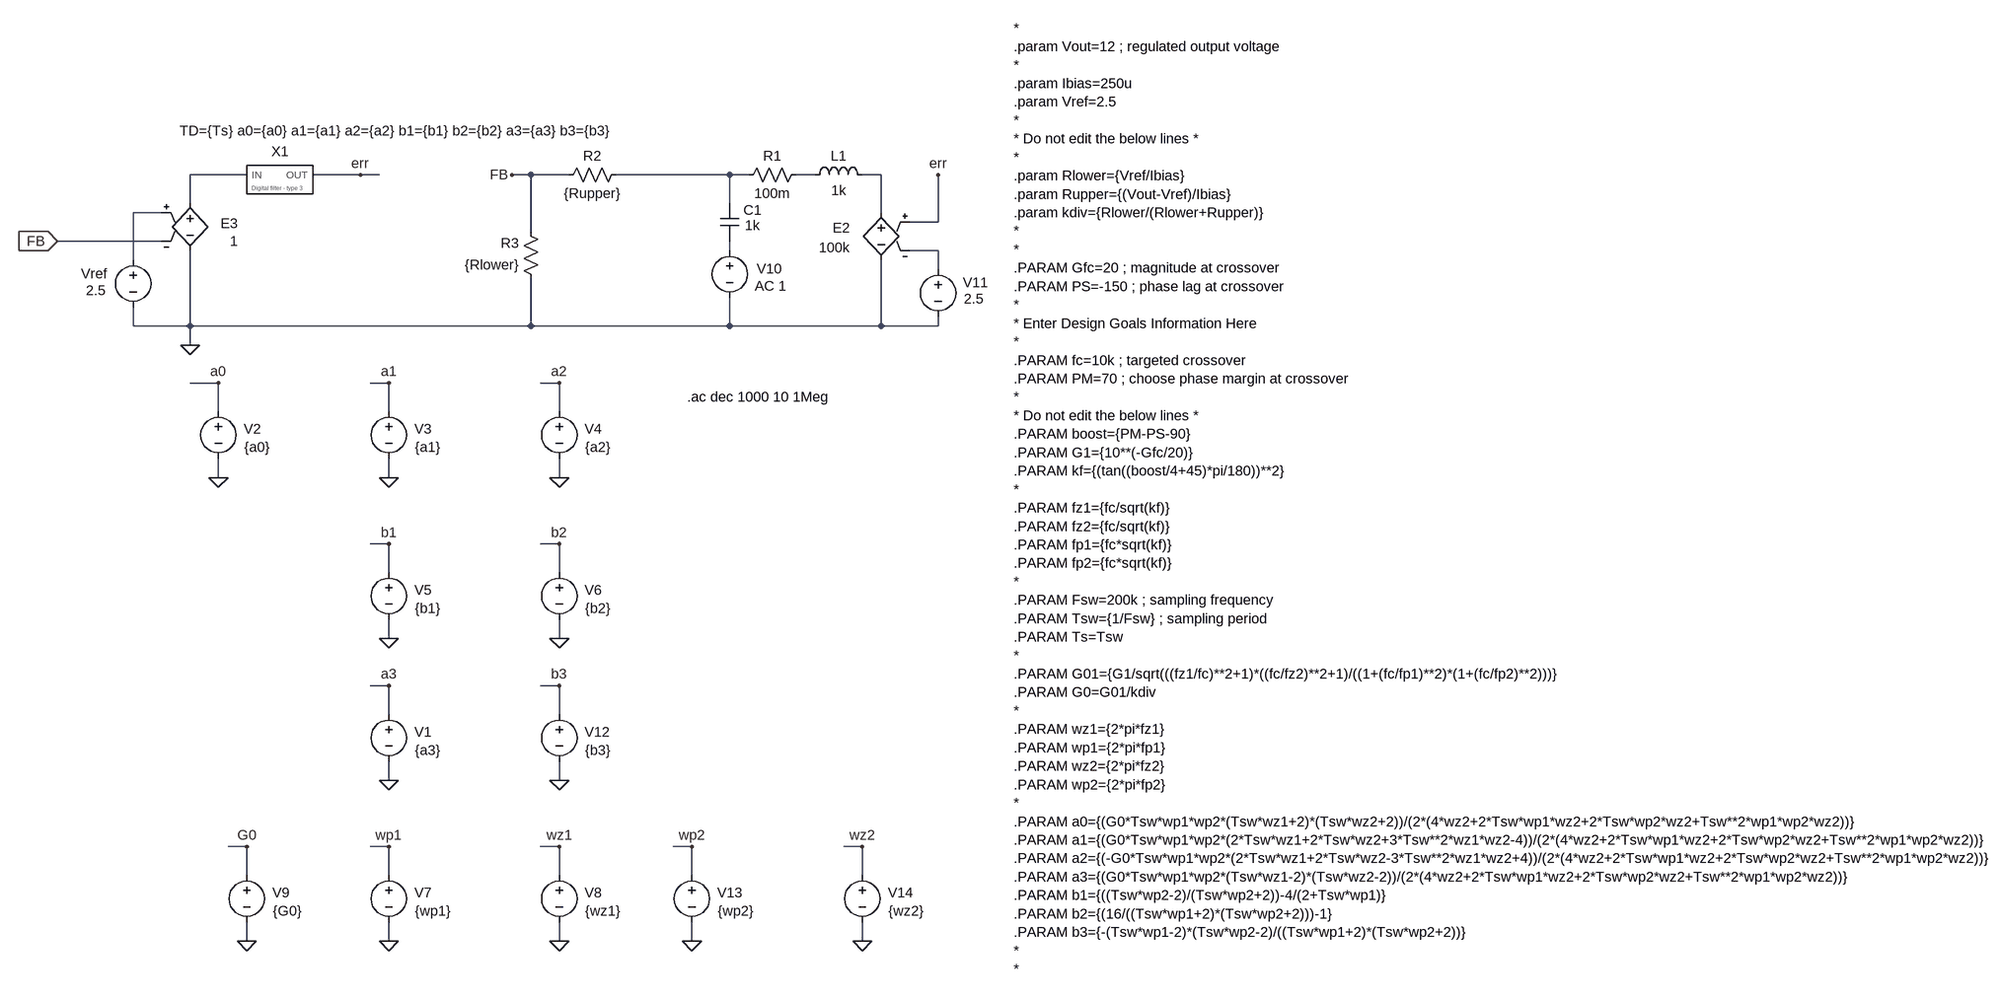
[diagram p0: schematic Type 3 digital - delay lines.asc]
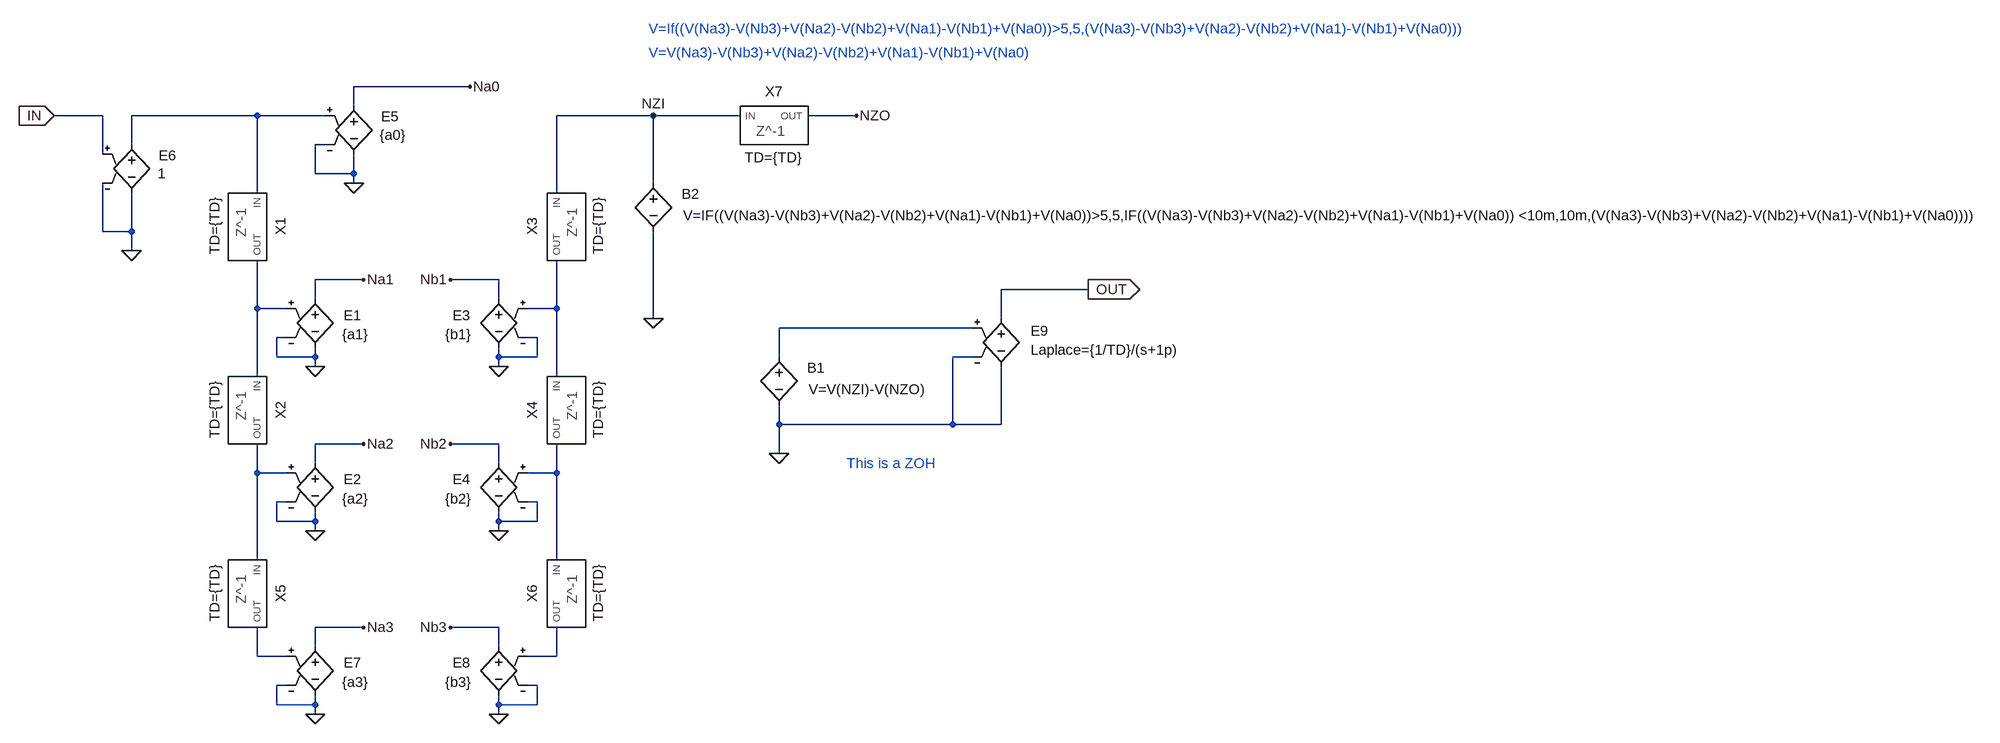
[diagram p1: sub-circuit type_3_digital.asc]
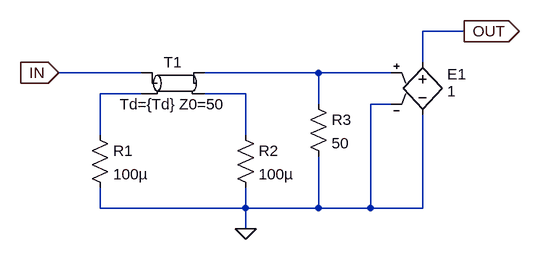
[diagram p2: sub-circuit zminus1.asc]
Type 3 digital - delay lines.asc, the LTspice schematic file:
Version 4
SHEET 1 2968 1524
WIRE -272 48 -368 48
WIRE -80 48 -160 48
WIRE -48 48 -80 48
WIRE 208 48 176 48
WIRE 272 48 208 48
WIRE 544 48 352 48
WIRE 576 48 544 48
WIRE 688 48 656 48
WIRE 800 48 768 48
WIRE -368 96 -368 48
WIRE 544 96 544 48
WIRE -416 112 -464 112
WIRE 800 112 800 48
WIRE 896 128 896 48
WIRE 896 128 848 128
WIRE 208 144 208 48
WIRE -416 160 -592 160
WIRE 544 176 544 160
WIRE 896 176 848 176
WIRE -464 192 -464 112
WIRE 896 208 896 176
WIRE -464 304 -464 272
WIRE -368 304 -368 176
WIRE -368 304 -464 304
WIRE 208 304 208 224
WIRE 208 304 -368 304
WIRE 544 304 544 256
WIRE 544 304 208 304
WIRE 800 304 800 192
WIRE 800 304 544 304
WIRE 896 304 896 288
WIRE 896 304 800 304
WIRE -368 336 -368 304
WIRE -320 400 -368 400
WIRE -32 400 -64 400
WIRE 256 400 224 400
WIRE -320 448 -320 400
WIRE -32 448 -32 400
WIRE 256 448 256 400
WIRE -320 560 -320 528
WIRE -32 560 -32 528
WIRE 256 560 256 528
WIRE -32 672 -64 672
WIRE 256 672 224 672
WIRE -32 720 -32 672
WIRE 256 720 256 672
WIRE -32 832 -32 800
WIRE 256 832 256 800
WIRE -32 912 -64 912
WIRE 256 912 224 912
WIRE -32 960 -32 912
WIRE 256 960 256 912
WIRE -32 1072 -32 1040
WIRE 256 1072 256 1040
WIRE -272 1184 -304 1184
WIRE -32 1184 -64 1184
WIRE 256 1184 224 1184
WIRE 480 1184 448 1184
WIRE 768 1184 736 1184
WIRE -272 1232 -272 1184
WIRE -32 1232 -32 1184
WIRE 256 1232 256 1184
WIRE 480 1232 480 1184
WIRE 768 1232 768 1184
WIRE -272 1344 -272 1312
WIRE -32 1344 -32 1312
WIRE 256 1344 256 1312
WIRE 480 1344 480 1312
WIRE 768 1344 768 1312
FLAG -368 336 0
FLAG -320 560 0
FLAG -32 560 0
FLAG -320 400 a0
FLAG -32 400 a1
FLAG 256 560 0
FLAG -32 832 0
FLAG 256 400 a2
FLAG -32 672 b1
FLAG 256 832 0
FLAG 256 672 b2
FLAG -32 1344 0
FLAG -32 1184 wp1
FLAG 256 1344 0
FLAG 256 1184 wz1
FLAG -80 48 err
FLAG -272 1344 0
FLAG -272 1184 G0
FLAG 896 48 err
FLAG 176 48 FB
FLAG -592 160 FB
IOPIN -592 160 In
FLAG -32 1072 0
FLAG -32 912 a3
FLAG 256 1072 0
FLAG 256 912 b3
FLAG 480 1344 0
FLAG 480 1184 wp2
FLAG 768 1344 0
FLAG 768 1184 wz2
DATAFLAG -368 400 ""
DATAFLAG -64 400 ""
DATAFLAG 224 400 ""
DATAFLAG -64 672 ""
DATAFLAG 224 672 ""
DATAFLAG -64 1184 ""
DATAFLAG 224 1184 ""
DATAFLAG -304 1184 ""
DATAFLAG 464 48 ""
DATAFLAG -48 48 ""
DATAFLAG -64 912 ""
DATAFLAG 224 912 ""
DATAFLAG 448 1184 ""
DATAFLAG 736 1184 ""
SYMBOL voltage -320 432 R0
WINDOW 0 43 46 Left 2
WINDOW 3 44 77 Left 2
SYMATTR InstName V2
SYMATTR Value {a0}
SYMBOL voltage -32 432 R0
WINDOW 0 43 46 Left 2
WINDOW 3 44 77 Left 2
SYMATTR InstName V3
SYMATTR Value {a1}
SYMBOL voltage 256 432 R0
WINDOW 0 43 46 Left 2
WINDOW 3 44 77 Left 2
SYMATTR InstName V4
SYMATTR Value {a2}
SYMBOL voltage -32 704 R0
WINDOW 0 43 46 Left 2
WINDOW 3 44 77 Left 2
SYMATTR InstName V5
SYMATTR Value {b1}
SYMBOL voltage 256 704 R0
WINDOW 0 43 46 Left 2
WINDOW 3 44 77 Left 2
SYMATTR InstName V6
SYMATTR Value {b2}
SYMBOL voltage -32 1216 R0
WINDOW 0 43 46 Left 2
WINDOW 3 44 77 Left 2
SYMATTR InstName V7
SYMATTR Value {wp1}
SYMBOL voltage 256 1216 R0
WINDOW 0 43 46 Left 2
WINDOW 3 44 77 Left 2
SYMATTR InstName V8
SYMATTR Value {wz1}
SYMBOL voltage -272 1216 R0
WINDOW 0 43 46 Left 2
WINDOW 3 44 77 Left 2
SYMATTR InstName V9
SYMATTR Value {G0}
SYMBOL e 800 96 M0
WINDOW 0 53 42 Left 2
WINDOW 3 53 75 Left 2
SYMATTR InstName E2
SYMATTR Value 100k
SYMBOL ind 672 64 R270
WINDOW 0 32 56 VTop 2
WINDOW 3 5 56 VBottom 2
SYMATTR InstName L1
SYMATTR Value 1k
SYMBOL res 672 32 R90
WINDOW 0 0 56 VBottom 2
WINDOW 3 32 56 VTop 2
SYMATTR InstName R1
SYMATTR Value 100m
SYMBOL cap 528 96 R0
WINDOW 0 39 12 Left 2
WINDOW 3 42 38 Left 2
SYMATTR InstName C1
SYMATTR Value 1k
SYMBOL voltage 544 160 R0
WINDOW 0 46 47 Left 2
WINDOW 123 42 76 Left 2
WINDOW 39 0 0 Left 0
SYMATTR InstName V10
SYMATTR Value2 AC 1
SYMATTR Value ""
SYMBOL voltage 896 192 R0
WINDOW 0 42 38 Left 2
WINDOW 3 44 66 Left 2
SYMATTR InstName V11
SYMATTR Value 2.5
SYMBOL res 368 32 R90
WINDOW 0 0 56 VBottom 2
WINDOW 3 32 56 VTop 2
SYMATTR InstName R2
SYMATTR Value {Rupper}
SYMBOL res 224 240 R180
WINDOW 0 36 76 Left 2
WINDOW 3 36 40 Left 2
SYMATTR InstName R3
SYMATTR Value {Rlower}
SYMBOL voltage -464 176 M0
WINDOW 0 44 39 Left 2
WINDOW 3 46 68 Left 2
SYMATTR InstName Vref
SYMATTR Value 2.5
SYMBOL e -368 80 R0
WINDOW 0 52 50 Left 2
WINDOW 3 68 80 Left 2
SYMATTR InstName E3
SYMATTR Value 1
SYMBOL Type_3_digital -224 48 R0
WINDOW 39 204 -59 Bottom 2
SYMATTR InstName X1
SYMATTR SpiceLine TD={Ts} a0={a0} a1={a1} a2={a2} b1={b1} b2={b2} a3={a3} b3={b3}
SYMBOL voltage -32 944 R0
WINDOW 0 43 46 Left 2
WINDOW 3 44 77 Left 2
WINDOW 123 0 0 Left 0
WINDOW 39 0 0 Left 0
SYMATTR InstName V1
SYMATTR Value {a3}
SYMBOL voltage 256 944 R0
WINDOW 0 43 46 Left 2
WINDOW 3 44 77 Left 2
SYMATTR InstName V12
SYMATTR Value {b3}
SYMBOL voltage 480 1216 R0
WINDOW 0 43 46 Left 2
WINDOW 3 44 77 Left 2
SYMATTR InstName V13
SYMATTR Value {wp2}
SYMBOL voltage 768 1216 R0
WINDOW 0 43 46 Left 2
WINDOW 3 44 77 Left 2
SYMATTR InstName V14
SYMATTR Value {wz2}
TEXT 1024 -200 Left 2 !*\n.param Vout=12 ; regulated output voltage\n*\n.param Ibias=250u\n.param Vref=2.5\n*\n* Do not edit the below lines *\n*\n.param Rlower={Vref/Ibias}\n.param Rupper={(Vout-Vref)/Ibias}\n.param kdiv={Rlower/(Rlower+Rupper)}\n*\n*\n.PARAM Gfc=20 ; magnitude at crossover\n.PARAM PS=-150 ; phase lag at crossover\n*\n* Enter Design Goals Information Here\n*\n.PARAM fc=10k ; targeted crossover\n.PARAM PM=70 ; choose phase margin at crossover\n*\n* Do not edit the below lines *\n.PARAM boost={PM-PS-90}\n.PARAM G1={10**(-Gfc/20)}\n.PARAM kf={(tan((boost/4+45)*pi/180))**2}\n*\n.PARAM fz1={fc/sqrt(kf)}\n.PARAM fz2={fc/sqrt(kf)}\n.PARAM fp1={fc*sqrt(kf)}\n.PARAM fp2={fc*sqrt(kf)}\n*\n.PARAM Fsw=200k ; sampling frequency\n.PARAM Tsw={1/Fsw} ; sampling period\n.PARAM Ts=Tsw\n*\n.PARAM G01={G1/sqrt(((fz1/fc)**2+1)*((fc/fz2)**2+1)/((1+(fc/fp1)**2)*(1+(fc/fp2)**2)))}\n.PARAM G0=G01/kdiv\n*\n.PARAM wz1={2*pi*fz1}\n.PARAM wp1={2*pi*fp1}\n.PARAM wz2={2*pi*fz2}\n.PARAM wp2={2*pi*fp2}\n*\n.PARAM a0={(G0*Tsw*wp1*wp2*(Tsw*wz1+2)*(Tsw*wz2+2))/(2*(4*wz2+2*Tsw*wp1*wz2+2*Tsw*wp2*wz2+Tsw**2*wp1*wp2*wz2))}\n.PARAM a1={(G0*Tsw*wp1*wp2*(2*Tsw*wz1+2*Tsw*wz2+3*Tsw**2*wz1*wz2-4))/(2*(4*wz2+2*Tsw*wp1*wz2+2*Tsw*wp2*wz2+Tsw**2*wp1*wp2*wz2))}\n.PARAM a2={(-G0*Tsw*wp1*wp2*(2*Tsw*wz1+2*Tsw*wz2-3*Tsw**2*wz1*wz2+4))/(2*(4*wz2+2*Tsw*wp1*wz2+2*Tsw*wp2*wz2+Tsw**2*wp1*wp2*wz2))}\n.PARAM a3={(G0*Tsw*wp1*wp2*(Tsw*wz1-2)*(Tsw*wz2-2))/(2*(4*wz2+2*Tsw*wp1*wz2+2*Tsw*wp2*wz2+Tsw**2*wp1*wp2*wz2))}\n.PARAM b1={((Tsw*wp2-2)/(Tsw*wp2+2))-4/(2+Tsw*wp1)}\n.PARAM b2={(16/((Tsw*wp1+2)*(Tsw*wp2+2)))-1}\n.PARAM b3={-(Tsw*wp1-2)*(Tsw*wp2-2)/((Tsw*wp1+2)*(Tsw*wp2+2))}\n*\n*
TEXT 472 424 Left 2 !.ac dec 1000 10 1Meg

type_3_digital.asc, the sub-circuit schematic file:
Version 4.1
SHEET 1 3284 692
WIRE 544 -368 352 -368
WIRE 352 -336 352 -368
WIRE -64 -320 -144 -320
WIRE 192 -320 -16 -320
WIRE 304 -320 192 -320
WIRE 848 -320 688 -320
WIRE 992 -320 848 -320
WIRE 1184 -320 1104 -320
WIRE -16 -272 -16 -320
WIRE 304 -272 288 -272
WIRE -64 -256 -64 -320
WIRE 288 -224 288 -272
WIRE 352 -224 352 -256
WIRE 352 -224 288 -224
WIRE 352 -208 352 -224
WIRE 848 -208 848 -320
WIRE 192 -192 192 -320
WIRE 688 -192 688 -320
WIRE -64 -128 -64 -208
WIRE -16 -128 -16 -192
WIRE -16 -128 -64 -128
WIRE -16 -96 -16 -128
WIRE 368 -48 288 -48
WIRE 592 -48 512 -48
WIRE 1568 -32 1424 -32
WIRE 288 -16 288 -48
WIRE 592 -16 592 -48
WIRE 192 0 192 -80
WIRE 240 0 192 0
WIRE 688 0 688 -80
WIRE 688 0 640 0
WIRE 848 16 848 -128
WIRE 1424 16 1424 -32
WIRE 1376 32 1056 32
WIRE 240 48 224 48
WIRE 656 48 640 48
WIRE 224 80 224 48
WIRE 288 80 288 64
WIRE 288 80 224 80
WIRE 592 80 592 64
WIRE 656 80 656 48
WIRE 656 80 592 80
WIRE 1056 80 1056 32
WIRE 1376 80 1344 80
WIRE 288 96 288 80
WIRE 592 96 592 80
WIRE 192 112 192 0
WIRE 688 112 688 0
WIRE 1056 192 1056 160
WIRE 1344 192 1344 80
WIRE 1344 192 1056 192
WIRE 1424 192 1424 96
WIRE 1424 192 1344 192
WIRE 368 224 288 224
WIRE 592 224 512 224
WIRE 1056 240 1056 192
WIRE 288 256 288 224
WIRE 592 256 592 224
WIRE 192 272 192 224
WIRE 240 272 192 272
WIRE 688 272 688 224
WIRE 688 272 640 272
WIRE 240 320 224 320
WIRE 656 320 640 320
WIRE 224 352 224 320
WIRE 288 352 288 336
WIRE 288 352 224 352
WIRE 592 352 592 336
WIRE 656 352 656 320
WIRE 656 352 592 352
WIRE 288 368 288 352
WIRE 592 368 592 352
WIRE 192 416 192 272
WIRE 688 416 688 272
WIRE 368 528 288 528
WIRE 592 528 512 528
WIRE 288 560 288 528
WIRE 592 560 592 528
WIRE 192 576 192 528
WIRE 240 576 192 576
WIRE 688 576 688 528
WIRE 688 576 640 576
WIRE 240 624 224 624
WIRE 656 624 640 624
WIRE 224 656 224 624
WIRE 288 656 288 640
WIRE 288 656 224 656
WIRE 592 656 592 640
WIRE 656 656 656 624
WIRE 656 656 592 656
WIRE 288 672 288 656
WIRE 592 672 592 656
FLAG 288 96 0
FLAG 288 368 0
FLAG 368 -48 Na1
FLAG 368 224 Na2
FLAG 592 96 0
FLAG 592 368 0
FLAG 512 -48 Nb1
FLAG 512 224 Nb2
FLAG 352 -208 0
FLAG 544 -368 Na0
FLAG 848 16 0
FLAG 1568 -32 OUT
IOPIN 1568 -32 Out
FLAG -144 -320 IN
IOPIN -144 -320 In
FLAG -16 -96 0
FLAG 288 672 0
FLAG 368 528 Na3
FLAG 592 672 0
FLAG 512 528 Nb3
FLAG 1184 -320 NZO
FLAG 848 -320 NZI
FLAG 1056 240 0
SYMBOL Zminus1 192 -144 R90
WINDOW 39 7 85 Bottom 2
SYMATTR SpiceLine TD={TD}
SYMATTR InstName X1
SYMBOL Zminus1 192 160 R90
WINDOW 39 7 85 Bottom 2
SYMATTR SpiceLine TD={TD}
SYMATTR InstName X2
SYMBOL e 288 -32 R0
WINDOW 0 47 43 Left 2
WINDOW 3 45 75 Left 2
SYMATTR InstName E1
SYMATTR Value {a1}
SYMBOL e 288 240 R0
WINDOW 0 47 43 Left 2
WINDOW 3 45 75 Left 2
SYMATTR InstName E2
SYMATTR Value {a2}
SYMBOL Zminus1 688 -144 M90
WINDOW 39 7 85 Bottom 2
SYMATTR SpiceLine TD={TD}
SYMATTR InstName X3
SYMBOL Zminus1 688 160 M90
WINDOW 39 7 85 Bottom 2
SYMATTR SpiceLine TD={TD}
SYMATTR InstName X4
SYMBOL e 592 -32 M0
WINDOW 0 47 43 Left 2
WINDOW 3 45 75 Left 2
SYMATTR InstName E3
SYMATTR Value {b1}
SYMBOL e 592 240 M0
WINDOW 0 47 43 Left 2
WINDOW 3 45 75 Left 2
SYMATTR InstName E4
SYMATTR Value {b2}
SYMBOL e 352 -352 R0
WINDOW 0 45 34 Left 2
WINDOW 3 43 64 Left 2
SYMATTR InstName E5
SYMATTR Value {a0}
SYMBOL e -16 -288 R0
WINDOW 0 45 34 Left 2
WINDOW 3 43 64 Left 2
SYMATTR InstName E6
SYMATTR Value 1
SYMBOL Zminus1 192 464 R90
WINDOW 39 7 85 Bottom 2
SYMATTR SpiceLine TD={TD}
SYMATTR InstName X5
SYMBOL e 288 544 R0
WINDOW 0 47 43 Left 2
WINDOW 3 45 75 Left 2
SYMATTR InstName E7
SYMATTR Value {a3}
SYMBOL Zminus1 688 464 M90
WINDOW 39 7 85 Bottom 2
SYMATTR SpiceLine TD={TD}
SYMATTR InstName X6
SYMBOL e 592 544 M0
WINDOW 0 47 43 Left 2
WINDOW 3 45 75 Left 2
SYMATTR InstName E8
SYMATTR Value {b3}
SYMBOL bv 848 -224 R0
WINDOW 0 47 34 Left 2
WINDOW 3 49 70 Left 2
SYMATTR InstName B2
SYMATTR Value V=IF((V(Na3)-V(Nb3)+V(Na2)-V(Nb2)+V(Na1)-V(Nb1)+V(Na0))>5,5,IF((V(Na3)-V(Nb3)+V(Na2)-V(Nb2)+V(Na1)-V(Nb1)+V(Na0)) <10m,10m,(V(Na3)-V(Nb3)+V(Na2)-V(Nb2)+V(Na1)-V(Nb1)+V(Na0))))
SYMBOL Zminus1 1040 -320 R0
WINDOW 39 7 85 Bottom 2
SYMATTR SpiceLine TD={TD}
SYMATTR InstName X7
SYMBOL bv 1056 64 R0
WINDOW 0 47 34 Left 2
WINDOW 3 49 70 Left 2
SYMATTR InstName B1
SYMATTR Value V=V(NZI)-V(NZO)
SYMBOL e 1424 0 R0
WINDOW 0 49 37 Left 2
WINDOW 3 49 68 Left 2
SYMATTR InstName E9
SYMATTR Value Laplace={1/TD}/(s+1p)
TEXT 1168 256 Left 2 ;This is a ZOH
TEXT 840 -424 Left 2 ;V=V(Na3)-V(Nb3)+V(Na2)-V(Nb2)+V(Na1)-V(Nb1)+V(Na0)
TEXT 840 -464 Left 2 ;V=If((V(Na3)-V(Nb3)+V(Na2)-V(Nb2)+V(Na1)-V(Nb1)+V(Na0))>5,5,(V(Na3)-V(Nb3)+V(Na2)-V(Nb2)+V(Na1)-V(Nb1)+V(Na0)))

zminus1.asc, the sub-circuit schematic file:
Version 4
SHEET 1 880 680
WIRE 624 80 560 80
WIRE 560 128 560 80
WIRE 128 144 0 144
WIRE 400 144 224 144
WIRE 512 144 400 144
WIRE 128 176 64 176
WIRE 288 176 224 176
WIRE 400 192 400 144
WIRE 512 192 480 192
WIRE 64 240 64 176
WIRE 288 240 288 176
WIRE 64 352 64 320
WIRE 288 352 288 320
WIRE 288 352 64 352
WIRE 400 352 400 272
WIRE 400 352 288 352
WIRE 480 352 480 192
WIRE 480 352 400 352
WIRE 560 352 560 208
WIRE 560 352 480 352
WIRE 288 384 288 352
FLAG 624 80 OUT
IOPIN 624 80 Out
FLAG 0 144 IN
IOPIN 0 144 In
FLAG 288 384 0
SYMBOL tline 176 160 R0
SYMATTR InstName T1
SYMATTR Value Td={Td} Z0=50
SYMBOL res 48 224 R0
SYMATTR InstName R1
SYMATTR Value 100µ
SYMBOL res 272 224 R0
SYMATTR InstName R2
SYMATTR Value 100µ
SYMBOL res 384 176 R0
SYMATTR InstName R3
SYMATTR Value 50
SYMBOL e 560 112 R0
WINDOW 0 38 34 Left 2
WINDOW 3 38 60 Left 2
SYMATTR InstName E1
SYMATTR Value 1

The netlist it stands for:
* Type 3 digital - delay lines.asc
V2 a0 0 {a0}
V3 a1 0 {a1}
V4 a2 0 {a2}
V5 b1 0 {b1}
V6 b2 0 {b2}
V7 wp1 0 {wp1}
V8 wz1 0 {wz1}
V9 G0 0 {G0}
E2 N004 0 err N007 100k
L1 N003 N004 1k
R1 N003 N002 100m
C1 N002 N006 1k
V10 N006 0 AC 1
V11 N007 0 2.5
R2 N002 FB {Rupper}
R3 0 FB {Rlower}
Vref N005 0 2.5
E3 N001 0 N005 FB 1
XX1 N001 err type_3_digital params: TD={Ts} a0={a0} a1={a1} a2={a2} b1={b1} b2={b2} a3={a3} b3={b3}
V1 a3 0 {a3}
V12 b3 0 {b3}
V13 wp2 0 {wp2}
V14 wz2 0 {wz2}

* block symbol definitions
.subckt type_3_digital IN OUT
X§X1 N001 N002 zminus1 params: TD={TD}
X§X2 N002 N005 zminus1 params: TD={TD}
E1 Na1 0 N002 0 {a1}
E2 Na2 0 N005 0 {a2}
X§X3 NZI N003 zminus1 params: TD={TD}
X§X4 N003 N006 zminus1 params: TD={TD}
E3 Nb1 0 N003 0 {b1}
E4 Nb2 0 N006 0 {b2}
E5 Na0 0 N001 0 {a0}
E6 N001 0 IN 0 1
X§X5 N005 N007 zminus1 params: TD={TD}
E7 Na3 0 N007 0 {a3}
X§X6 N006 N008 zminus1 params: TD={TD}
E8 Nb3 0 N008 0 {b3}
B2 NZI 0 V=IF((V(Na3)-V(Nb3)+V(Na2)-V(Nb2)+V(Na1)-V(Nb1)+V(Na0))>5,5,IF((V(Na3)-V(Nb3)+V(Na2)-V(Nb2)+V(Na1)-V(Nb1)+V(Na0)) <10m,10m,(V(Na3)-V(Nb3)+V(Na2)-V(Nb2)+V(Na1)-V(Nb1)+V(Na0))))
X§X7 NZI NZO zminus1 params: TD={TD}
B1 N004 0 V=V(NZI)-V(NZO)
E9 OUT 0 N004 0 Laplace={1/TD}/(s+1p)
* This is a ZOH
* V=V(Na3)-V(Nb3)+V(Na2)-V(Nb2)+V(Na1)-V(Nb1)+V(Na0)
* V=If((V(Na3)-V(Nb3)+V(Na2)-V(Nb2)+V(Na1)-V(Nb1)+V(Na0))>5,5,(V(Na3)-V(Nb3)+V(Na2)-V(Nb2)+V(Na1)-V(Nb1)+V(Na0)))
.ends type_3_digital

.subckt zminus1 IN OUT
T1 IN N002 N001 N003 Td={Td} Z0=50
R1 N002 0 100µ
R2 N003 0 100µ
R3 N001 0 50
E1 OUT 0 N001 0 1
.ends zminus1

*
.param Vout=12 ; regulated output voltage
*
.param Ibias=250u
.param Vref=2.5
*
* Do not edit the below lines *
*
.param Rlower={Vref/Ibias}
.param Rupper={(Vout-Vref)/Ibias}
.param kdiv={Rlower/(Rlower+Rupper)}
*
*
.PARAM Gfc=20 ; magnitude at crossover
.PARAM PS=-150 ; phase lag at crossover
*
* Enter Design Goals Information Here
*
.PARAM fc=10k ; targeted crossover
.PARAM PM=70 ; choose phase margin at crossover
*
* Do not edit the below lines *
.PARAM boost={PM-PS-90}
.PARAM G1={10**(-Gfc/20)}
.PARAM kf={(tan((boost/4+45)*pi/180))**2}
*
.PARAM fz1={fc/sqrt(kf)}
.PARAM fz2={fc/sqrt(kf)}
.PARAM fp1={fc*sqrt(kf)}
.PARAM fp2={fc*sqrt(kf)}
*
.PARAM Fsw=200k ; sampling frequency
.PARAM Tsw={1/Fsw} ; sampling period
.PARAM Ts=Tsw
*
.PARAM G01={G1/sqrt(((fz1/fc)**2+1)*((fc/fz2)**2+1)/((1+(fc/fp1)**2)*(1+(fc/fp2)**2)))}
.PARAM G0=G01/kdiv
*
.PARAM wz1={2*pi*fz1}
.PARAM wp1={2*pi*fp1}
.PARAM wz2={2*pi*fz2}
.PARAM wp2={2*pi*fp2}
*
.PARAM a0={(G0*Tsw*wp1*wp2*(Tsw*wz1+2)*(Tsw*wz2+2))/(2*(4*wz2+2*Tsw*wp1*wz2+2*Tsw*wp2*wz2+Tsw**2*wp1*wp2*wz2))}
.PARAM a1={(G0*Tsw*wp1*wp2*(2*Tsw*wz1+2*Tsw*wz2+3*Tsw**2*wz1*wz2-4))/(2*(4*wz2+2*Tsw*wp1*wz2+2*Tsw*wp2*wz2+Tsw**2*wp1*wp2*wz2))}
.PARAM a2={(-G0*Tsw*wp1*wp2*(2*Tsw*wz1+2*Tsw*wz2-3*Tsw**2*wz1*wz2+4))/(2*(4*wz2+2*Tsw*wp1*wz2+2*Tsw*wp2*wz2+Tsw**2*wp1*wp2*wz2))}
.PARAM a3={(G0*Tsw*wp1*wp2*(Tsw*wz1-2)*(Tsw*wz2-2))/(2*(4*wz2+2*Tsw*wp1*wz2+2*Tsw*wp2*wz2+Tsw**2*wp1*wp2*wz2))}
.PARAM b1={((Tsw*wp2-2)/(Tsw*wp2+2))-4/(2+Tsw*wp1)}
.PARAM b2={(16/((Tsw*wp1+2)*(Tsw*wp2+2)))-1}
.PARAM b3={-(Tsw*wp1-2)*(Tsw*wp2-2)/((Tsw*wp1+2)*(Tsw*wp2+2))}
*
*
.ac dec 1000 10 1Meg
.backanno
.end